# EAGLE schematic v2.0 (EAGLE 6.1)
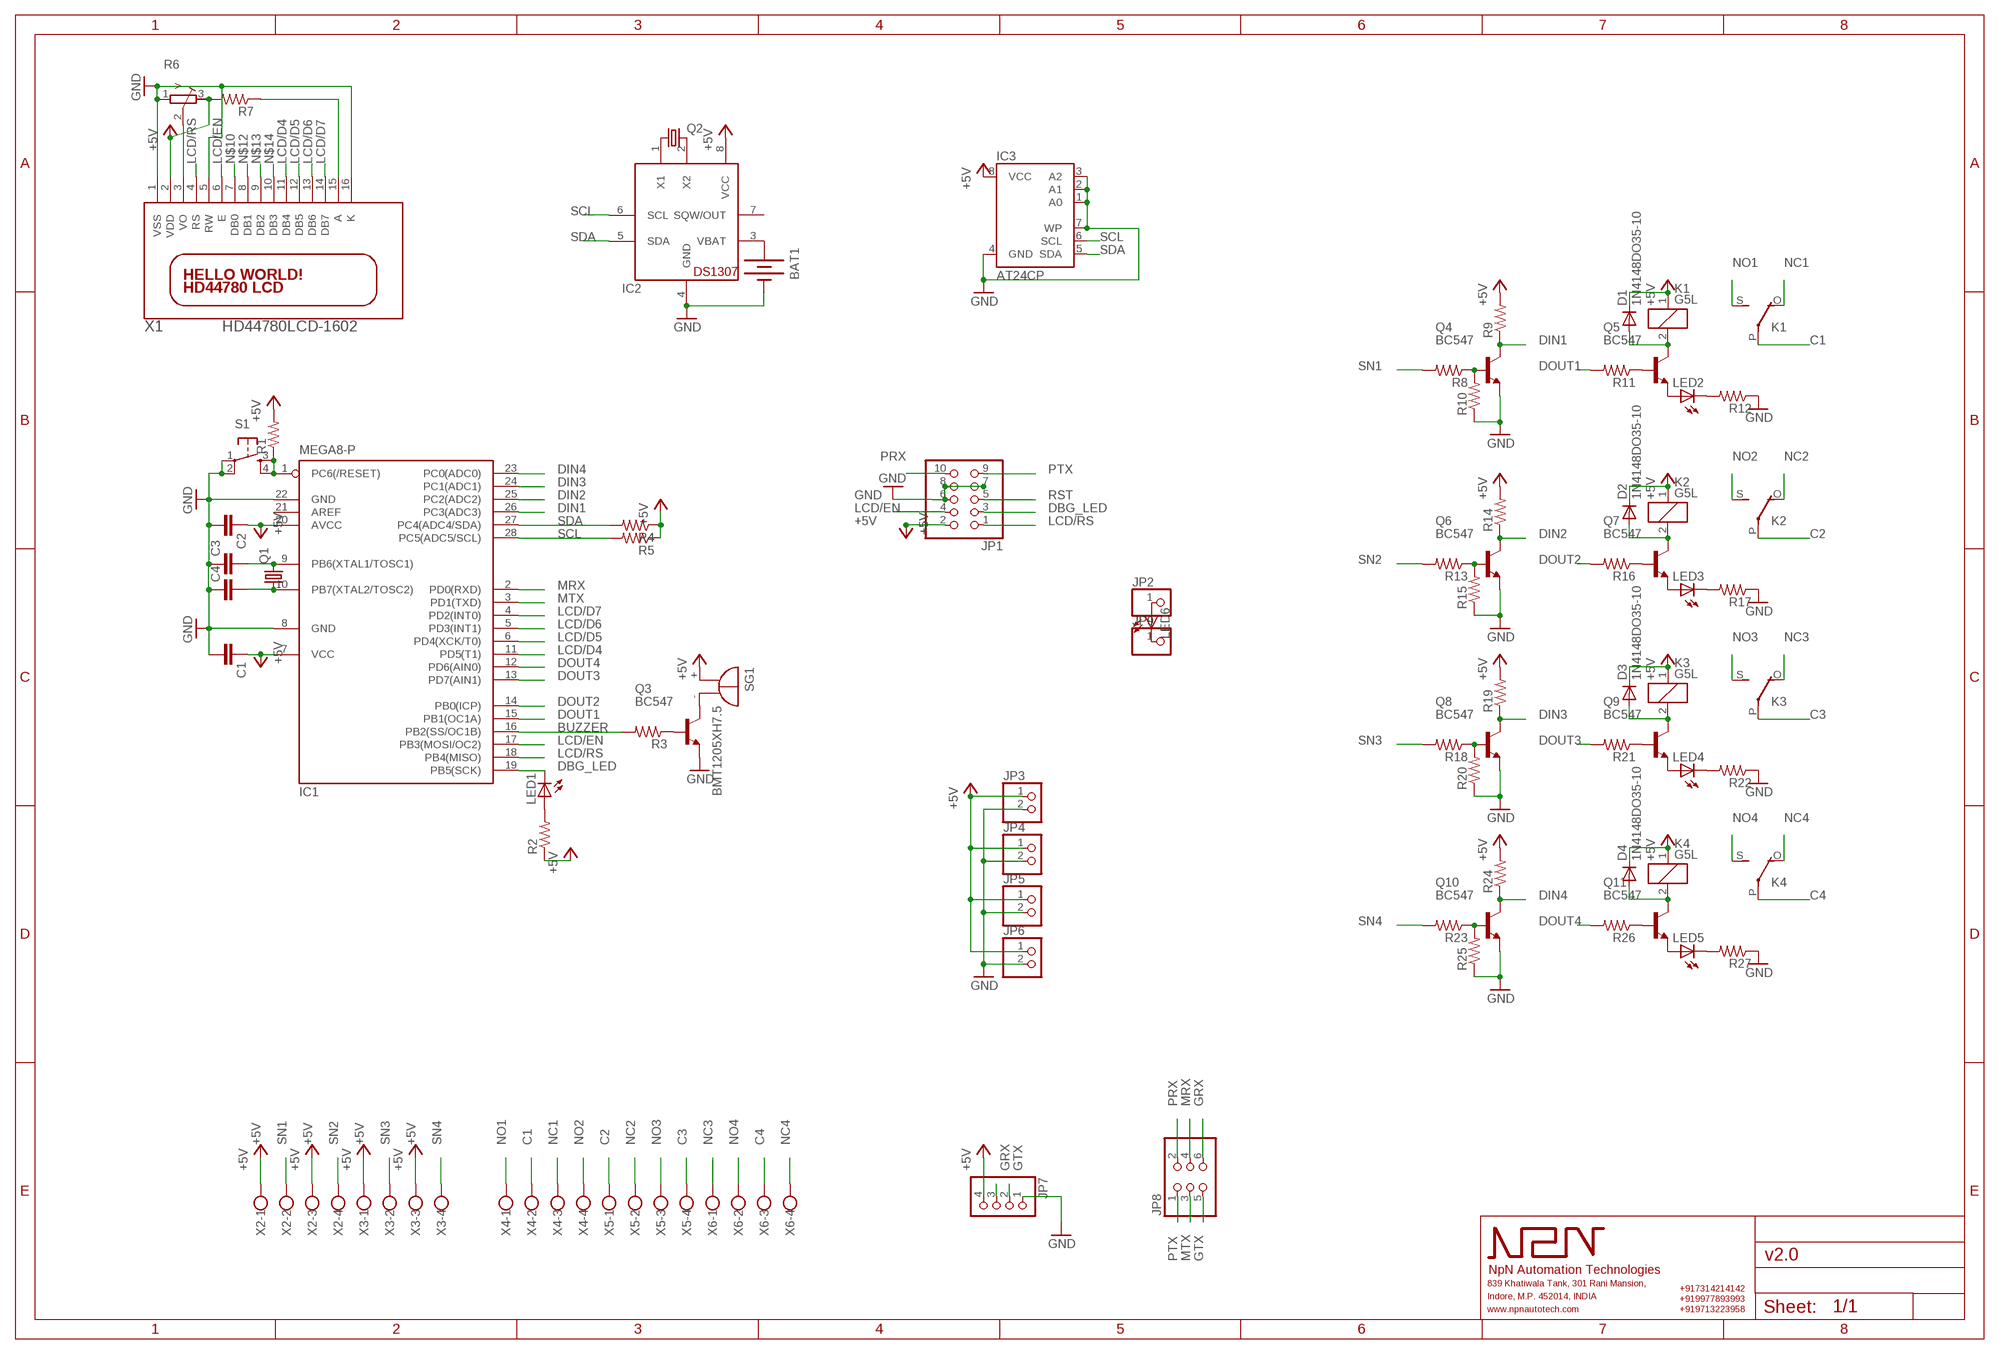
[diagram p0: schematic, sheet 1]

## Parts
BAT1  BATTERY20PTH  [BATTCOM_20MM_PTH]
C1  C-EU050-025X075  [C050-025X075]
C2  C-EU050-025X075  [C050-025X075]
C3  C-EU050-025X075  [C050-025X075]
C4  C-EU050-025X075  [C050-025X075]
D1  1N4148DO35-10  [DO35-10]
D2  1N4148DO35-10  [DO35-10]
D3  1N4148DO35-10  [DO35-10]
D4  1N4148DO35-10  [DO35-10]
IC1  MEGA8-P  [DIL28-3]
IC2  DS1307  [DIL08]
IC3  AT24CP  [DIL08]
JP1  PINHD-2X5  [2X05]
JP2  PINHD-1X1  [1X01]
JP3  PINHD-1X2  [1X02]
JP4  PINHD-1X2  [1X02]
JP5  PINHD-1X2  [1X02]
JP6  PINHD-1X2  [1X02]
JP7  PINHD-1X4  [1X04]
JP8  PINHD-2X3  [2X03]
JP9  PINHD-1X1  [1X01]
K1  G5L  [G5LE]
K2  G5L  [G5LE]
K3  G5L  [G5LE]
K4  G5L  [G5LE]
LED1  LED5MM  [LED5MM]
LED2  LED5MM  [LED5MM]
LED3  LED5MM  [LED5MM]
LED4  LED5MM  [LED5MM]
LED5  LED5MM  [LED5MM]
LED6  LED5MM  [LED5MM]
Q1  CRYSTALHC49U-V  [HC49U-V]
Q2  CRYSTALTC38H  [TC38H]
Q3  BC547  [TO92]
Q4  BC547  [TO92]
Q5  BC547  [TO92]
Q6  BC547  [TO92]
Q7  BC547  [TO92]
Q8  BC547  [TO92]
Q9  BC547  [TO92]
Q10  BC547  [TO92]
Q11  BC547  [TO92]
R1  R-US_0207/10  [0207/10]
R2  R-US_0207/10  [0207/10]
R3  R-US_0207/10  [0207/10]
R4  R-US_0207/10  [0207/10]
R5  R-US_0207/10  [0207/10]
R6  R-TRIMM3339P  [RTRIM3339P]
R7  R-US_0207/10  [0207/10]
R8  R-US_0207/10  [0207/10]
R9  R-US_0207/10  [0207/10]
R10  R-US_0207/10  [0207/10]
R11  R-US_0207/10  [0207/10]
R12  R-US_0207/10  [0207/10]
R13  R-US_0207/10  [0207/10]
R14  R-US_0207/10  [0207/10]
R15  R-US_0207/10  [0207/10]
R16  R-US_0207/10  [0207/10]
R17  R-US_0207/10  [0207/10]
R18  R-US_0207/10  [0207/10]
R19  R-US_0207/10  [0207/10]
R20  R-US_0207/10  [0207/10]
R21  R-US_0207/10  [0207/10]
R22  R-US_0207/10  [0207/10]
R23  R-US_0207/10  [0207/10]
R24  R-US_0207/10  [0207/10]
R25  R-US_0207/10  [0207/10]
R26  R-US_0207/10  [0207/10]
R27  R-US_0207/10  [0207/10]
S1  TAC_SWITCHPTH  [TACTILE-PTH]
SG1  BMT1205XH7.5  [BMT1205XH7.5]
X1  HD44780LCD-1602  [LCD1602]
X2  W237-4  [W237-4]
X3  W237-4  [W237-4]
X4  W237-4  [W237-4]
X5  W237-4  [W237-4]
X6  W237-4  [W237-4]

## Nets
+5V: C1.1 C2.1 D1.C D2.C D3.C D4.C IC1.7(VCC) IC1.20(AVCC) IC2.8(VCC) IC3.8(VCC) JP1.2 JP3.1 JP4.1 JP5.1 JP6.1 JP7.4 K1.1 K2.1 K3.1 K4.1 R1.2 R2.1 R4.1 R5.1 R6.3(E) R7.2 R9.2 R14.2 R19.2 R24.2 SG1.+ X1.2(VDD) X2.1 X2.3 X3.1 X3.3
BUZZER: IC1.16(PB2(SS/OC1B)) R3.2
C1: K1.P(2:P) X4.2
C2: K2.P(2:P) X5.1
C3: K3.P(2:P) X5.4
C4: K4.P(2:P) X6.3
DBG_LED: IC1.19(PB5(SCK)) JP1.3 LED1.K(C)
DIN1: IC1.26(PC3(ADC3)) Q4.3(C) R9.1
DIN2: IC1.25(PC2(ADC2)) Q6.3(C) R14.1
DIN3: IC1.24(PC1(ADC1)) Q8.3(C) R19.1
DIN4: IC1.23(PC0(ADC0)) Q10.3(C) R24.1
DOUT1: IC1.15(PB1(OC1A)) R11.2
DOUT2: IC1.14(PB0(ICP)) R16.2
DOUT3: IC1.13(PD7(AIN1)) R21.2
DOUT4: IC1.12(PD6(AIN0)) R26.2
GND: BAT1.2(-) C1.2 C2.2 C3.1 C4.1 IC1.8(GND) IC1.22(GND) IC2.4(GND) IC3.1(A0) IC3.2(A1) IC3.3(A2) IC3.4(GND) IC3.7(WP) JP1.6 JP1.7 JP1.8 JP3.2 JP4.2 JP5.2 JP6.2 JP7.1 Q3.1(E) Q4.1(E) Q6.1(E) Q8.1(E) Q10.1(E) R6.1(A) R10.1 R12.1 R15.1 R17.1 R20.1 R22.1 R25.1 R27.1 S1.1 S1.2 X1.1(VSS) X1.5(RW) X1.16(K)
GRX: JP7.3 JP8.6
GTX: JP7.2 JP8.5
LCD/D4: IC1.11(PD5(T1)) X1.11(DB4)
LCD/D5: IC1.6(PD4(XCK/T0)) X1.12(DB5)
LCD/D6: IC1.5(PD3(INT1)) X1.13(DB6)
LCD/D7: IC1.4(PD2(INT0)) X1.14(DB7)
LCD/EN: IC1.17(PB3(MOSI/OC2)) JP1.4 X1.6(E)
LCD/RS: IC1.18(PB4(MISO)) JP1.1 X1.4(RS)
MRX: IC1.2(PD0(RXD)) JP8.4
MTX: IC1.3(PD1(TXD)) JP8.3
N$1: IC2.2(X2) Q2.2
N$2: R7.1 X1.15(A)
N$3: IC2.1(X1) Q2.1
N$4: LED1.A R2.2
N$5: C3.2 IC1.9(PB6(XTAL1/TOSC1)) Q1.2
N$6: C4.2 IC1.10(PB7(XTAL2/TOSC2)) Q1.1
N$7: Q3.2(B) R3.1
N$8: Q3.3(C) SG1.-
N$9: R6.2(S) X1.3(VO)
N$10: X1.7(DB0)
N$11: BAT1.1(+) IC2.3(VBAT)
N$12: X1.8(DB1)
N$13: X1.9(DB2)
N$14: X1.10(DB3)
N$15: JP2.1 LED6.A
N$16: Q4.2(B) R8.1 R10.2
N$17: JP9.1 LED6.K(C)
N$18: Q5.2(B) R11.1
N$19: LED2.A Q5.1(E)
N$20: LED2.K(C) R12.2
N$21: D1.A K1.2 Q5.3(C)
N$27: Q6.2(B) R13.1 R15.2
N$28: Q7.2(B) R16.1
N$29: LED3.A Q7.1(E)
N$30: LED3.K(C) R17.2
N$31: D2.A K2.2 Q7.3(C)
N$32: Q8.2(B) R18.1 R20.2
N$33: Q9.2(B) R21.1
N$34: LED4.A Q9.1(E)
N$35: LED4.K(C) R22.2
N$36: D3.A K3.2 Q9.3(C)
N$37: Q10.2(B) R23.1 R25.2
N$38: Q11.2(B) R26.1
N$39: LED5.A Q11.1(E)
N$40: LED5.K(C) R27.2
N$41: D4.A K4.2 Q11.3(C)
NC1: K1.O(2:O) X4.3
NC2: K2.O(2:O) X5.2
NC3: K3.O(2:O) X6.1
NC4: K4.O(2:O) X6.4
NO1: K1.S(2:S) X4.1
NO2: K2.S(2:S) X4.4
NO3: K3.S(2:S) X5.3
NO4: K4.S(2:S) X6.2
PRX: JP1.10 JP8.2
PTX: JP1.9 JP8.1
RST: IC1.1(PC6(/RESET)) JP1.5 R1.1 S1.3 S1.4
SCL: IC1.28(PC5(ADC5/SCL)) IC2.6(SCL) IC3.6(SCL) R5.2
SDA: IC1.27(PC4(ADC4/SDA)) IC2.5(SDA) IC3.5(SDA) R4.2
SN1: R8.2 X2.2
SN2: R13.2 X2.4
SN3: R18.2 X3.2
SN4: R23.2 X3.4
Unconnected: IC1.21(AREF) IC2.7(SQW/OUT)

## Library data of the parts
BAT1 = SparkFun-Electromechanical:BATTERY: Battery Holders Various common sizes : AA, AAA, 20mm coin cell and 12mm coin cell. 20MM_4LEGS, BATT-10373
C1-C4 = rcl:C-EU: CAPACITOR, European symbol
D1-D4 = diode:1N4148: DIODE high speed (Philips)
IC1 = atmel:MEGA8-P: MICROCONTROLLER 8 Kbytes FLASH, 1 kbytes SRAM, 512 bytes EEPROM, USART, 4-channel 10 bit ADC, 2-channel 8 bit ADC Pin compatible with Atmega48, ATMega88, ATMega168 Source: avr.lbr; OC_FARNELL: unknown; OC_NEWARK: unknown
IC2 = adafruit:DS1307: DS1307 Real time clock (RTC) with battery backup ability. Talk to it via i2c
IC3 = atmel:AT24C*: 2-wire serial EEPROM; MPN: AT24C1024BW-SH-B; OC_FARNELL: 1362646; OC_NEWARK: 03P2044
JP1 = pinhead:PINHD-2X5: PIN HEADER
JP2 JP9 = pinhead:PINHD-1X1: PIN HEADER
JP3-JP6 = pinhead:PINHD-1X2: PIN HEADER
JP7 = pinhead:PINHD-1X4: PIN HEADER
JP8 = pinhead:PINHD-2X3: PIN HEADER
K1-K4 = relay:G5L: RELAY 1 x switch, 10 A/120 V AC, 8 A/30 V ADC, Omron; OC_FARNELL: unknown; OC_NEWARK: unknown
LED1-LED6 = led:LED: LED OSRAM: - CHIPLED LG R971, LG N971, LY N971, LG Q971, LY Q971, LO R971, LY R971 LH N974, LH R974 LS Q976, LO Q976, LY Q976 LO Q996 - Hyper CHIPLED LW Q18S LB Q993, LB Q99A, LB R99A - SideLED LS A670, LO A670, LY A670, LG A670, LP A670 LB A673, LV A673, LT A673, LW A673 LH A674 LY A675 LS A676, LA A676, LO A676, LY A676, LW A676 LS A679, LY A679, LG A679 - Hyper Micro SIDELED® LS Y876, LA Y876, LO Y876, LY Y876 LT Y87S - SmartLED LW L88C, LW L88S LB L89C, LB L89S, LG L890 LS L89K, LO L89K, LY L89K LS L896, LA L896, LO L896, LY L896 - TOPLED LS T670, LO T670, LY T670, LG T670, LP T670 LSG T670, LSP T670, LSY T670, LOP T670, LYG T670 LG T671, LOG T671, LSG T671 LB T673, LV T673, LT T673, LW T673 LH T674 LS T676, LA T676, LO T676, LY T676, LB T676, LH T676, LSB T676, LW T676 LB T67C, LV T67C, LT T67C, LS T67K, LO T67K, LY T67K, LW E67C LS E67B, LA E67B, LO E67B, LY E67B, LB E67C, LV E67C, LT E67C LW T67C LS T679, LY T679, LG T679 LS T770, LO T770, LY T770, LG T770, LP T770 LB T773, LV T773, LT T773, LW T773 LH T774 LS E675, LA E675, LY E675, LS T675 LS T776, LA T776, LO T776, LY T776, LB T776 LHGB T686 LT T68C, LB T68C - Hyper Mini TOPLED® LB M676 - Mini TOPLED Santana® LG M470 LS M47K, LO M47K, LY M47K Source: http://www.osram.convergy.de LUXEON: - LUMILED® LXK2-PW12-R00, LXK2-PW12-S00, LXK2-PW14-U00, LXK2-PW14-V00 LXK2-PM12-R00, LXK2-PM12-S00, LXK2-PM14-U00 LXK2-PE12-Q00, LXK2-PE12-R00, LXK2-PE12-S00, LXK2-PE14-T00, LXK2-PE14-U00 LXK2-PB12-K00, LXK2-PB12-L00, LXK2-PB12-M00, LXK2-PB14-N00, LXK2-PB14-P00, LXK2-PB14-Q00 LXK2-PR12-L00, LXK2-PR12-M00, LXK2-PR14-Q00, LXK2-PR14-R00 LXK2-PD12-Q00, LXK2-PD12-R00, LXK2-PD12-S00 LXK2-PH12-R00, LXK2-PH12-S00 LXK2-PL12-P00, LXK2-PL12-Q00, LXK2-PL12-R00 Source: www.luxeon.com KINGBRIGHT: KA-3528ASYC Source: www.kingbright.com
Q1 = crystal:CRYSTAL: CRYSTAL; OC_FARNELL: 1666969; OC_NEWARK: unknown
Q2 = crystal:CRYSTAL: CRYSTAL; OC_FARNELL: unknown; OC_NEWARK: unknown
Q3-Q11 = transistor-npn:BC547*: NPN Transistor
R1-R5 R7-R27 = rcl:R-US_: RESISTOR, American symbol
R6 = rcl:R-TRIMM: Trimm resistor
S1 = SparkFun-Electromechanical:TAC_SWITCH: Momentary Switch Button commonly used for reset or general input. Spark Fun Electronics SKU : COM-00097 SMT- SWCH-08247
SG1 = buzzer:BMT1205XH7.5: MAGNETIC TRANSDUCER Source: Http:www.be-star.com; OC_FARNELL: unknown; OC_NEWARK: unknown
X1 = adafruit:HD44780LCD: HD44780 LCD Standard character type LCDs, available in sizes from 8x1 to 40x4!
X2-X6 = con-wago-500:W237-4: WAGO SCREW CLAMP; OC_FARNELL: unknown; OC_NEWARK: unknown